# Altium project Morpheus_middle.PrjPcb
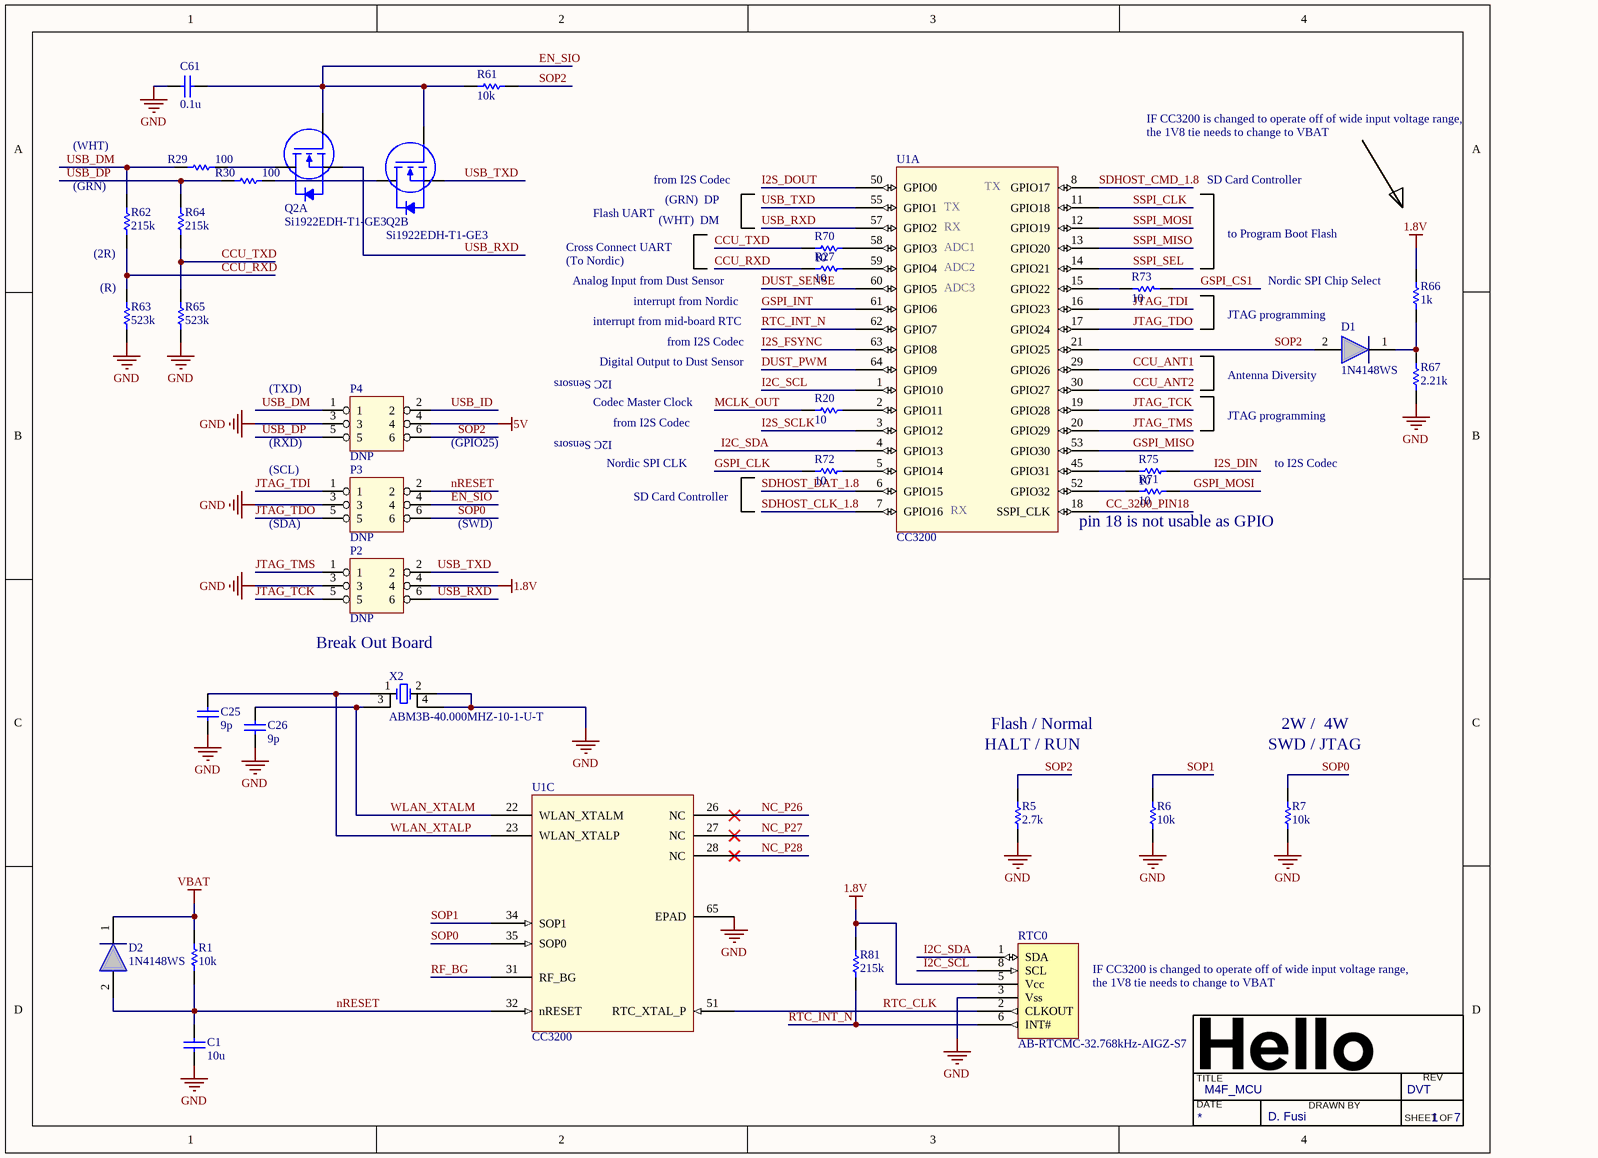
[diagram p0: M4F_MCU.SchDoc]
7 sheets, 151 parts. Net scope: global (net labels, ports and power ports of the same name join across sheets).
Board file: Morpheus_middle.PcbDoc
Sheets:
  M4F_MCU.SchDoc
  Morpheus_middle.SchDoc
  M4F_MCU_Power.SchDoc
  Air_quality.SchDoc
  Flash.SchDoc
  M4F_MCU_Antennas.SchDoc
  SD_Card.SchDoc

## Sheet M4F_MCU.SchDoc: M4F_MCU
size Letter; DrawnBy: D. Fusi; DocumentNumber: 1; Revision: DVT; SheetNumber: 1; SheetTotal: 7

### Parts
C1  10u  [CAP0603_SENSE_DVT]
C25  9p  [CAP0402_SENSE_DVT]
C26  9p  [CAP0402_SENSE_DVT]
C61  0.1u  [CAP0603_SENSE_DVT]
D1  1N4148WS  [SOD-323]
D2  1N4148WS  [SOD-323]
P2  DNP  [HDR2.00-2X3-SMD]
P3  DNP  [HDR2.00-2X3-SMD]
P4  DNP  [HDR2.00-2X3-SMD]
Q2  Si1922EDH-T1-GE3  [SC-70-6]  (parts A,B of 2)
R1  10k  [RES0402_SENSE_DVT]
R5  2.7k  [RES0402_SENSE_DVT]
R6  10k  [RES0402_SENSE_DVT]
R7  10k  [RES0402_SENSE_DVT]
R20  10  [RES0402_SENSE_DVT]
R27  10  [RES0402_SENSE_DVT]
R29  100  [RES0402_SENSE_DVT]
R30  100  [RES0402_SENSE_DVT]
R61  10k  [RES0402_SENSE_DVT]
R62  215k  [RES0402_SENSE_DVT]
R63  523k  [RES0402_SENSE_DVT]
R64  215k  [RES0402_SENSE_DVT]
R65  523k  [RES0402_SENSE_DVT]
R66  1k  [RES0402_SENSE_DVT]
R67  2.21k  [RES0402]
R70  10  [RES0402_SENSE_DVT]
R71  10  [RES0402_SENSE_DVT]
R72  10  [RES0402_SENSE_DVT]
R73  10  [RES0402_SENSE_DVT]
R75  10  [RES0402_SENSE_DVT]
R81  215k  [RES0402_SENSE_DVT]
RTC0  AB-RTCMC-32.768kHz-AIGZ-S7  [8-CLCC]
U1  CC3200  [QFN50P900X900X100_HS-65N]  (parts A,C of 3)
X2  ABM3B-40.000MHZ-10-1-U-T  [ABM3B_CRYSTAL]

### Nets
1.8V: P2.4 R66.2 R81.2 RTC0.5(Vcc)
5V: P4.4
GND: C1.1 C25.1 C26.1 C61.2 P2.3 P3.3 P4.3 R5.1 R6.1 R7.1 R63.1 R65.1 R67.1 RTC0.3(Vss) U1.65(EPAD) X2.2 X2.4
VBAT: D2.1(Cathode) R1.2
CC_3200_PIN18: U1.18(SSPI_CLK)
CCU_ANT1: U1.29(GPIO26)
CCU_ANT2: U1.30(GPIO27)
CCU_RXD: R27.2 R62.1 R63.2
CCU_TXD: R64.1 R65.2 R70.2
DUST_PWM: U1.64(GPIO9)
DUST_SENSE: U1.60(GPIO5)
EN_SIO: C61.1 P3.4 Q2.2(G1) Q2.5(G2) R61.2
GSPI_CLK: R72.2
GSPI_CS1: R73.2
GSPI_INT: U1.61(GPIO6)
GSPI_MISO: U1.53(GPIO30)
GSPI_MOSI: R71.1
I2C_SCL: RTC0.8(SCL) U1.1(GPIO10)
I2C_SDA: RTC0.1(SDA) U1.4(GPIO13)
I2S_DIN: R75.1
I2S_DOUT: U1.50(GPIO0)
I2S_FSYNC: U1.63(GPIO8)
I2S_SCLK: U1.3(GPIO12)
JTAG_TCK: P2.5 U1.19(GPIO28)
JTAG_TDI: P3.1 U1.16(GPIO23)
JTAG_TDO: P3.5 U1.17(GPIO24)
JTAG_TMS: P2.1 U1.20(GPIO29)
MCLK_OUT: R20.2
NC_P26: U1.26(NC)
NC_P27: U1.27(NC)
NC_P28: U1.28(NC)
nRESET: C1.2 D2.2(Anode) P3.2 R1.1 U1.32(nRESET)
RF_BG: U1.31(RF_BG)
RTC_CLK: RTC0.2(CLKOUT) U1.51(RTC_XTAL_P)
RTC_INT_N: R81.1 RTC0.6(INT#) U1.62(GPIO7)
SDHOST_CLK_1.8: U1.7(GPIO16)
SDHOST_CMD_1.8: U1.8(GPIO17)
SDHOST_DAT_1.8: U1.6(GPIO15)
SOP0: P3.6 R7.2 U1.35(SOP0)
SOP1: R6.2 U1.34(SOP1)
SOP2: D1.2(Anode) P4.6 R5.2 R61.1 U1.21(GPIO25)
SSPI_CLK: U1.11(GPIO18)
SSPI_MISO: U1.13(GPIO20)
SSPI_MOSI: U1.12(GPIO19)
SSPI_SEL: U1.14(GPIO21)
USB_DM: P4.1 R29.1 R62.2
USB_DP: P4.5 R30.1 R64.2
USB_ID: P4.2
USB_RXD: P2.6 Q2.1(S1) U1.57(GPIO2)
USB_TXD: P2.2 Q2.4(S2) U1.55(GPIO1)
WLAN_XTALM: C26.2 U1.22(WLAN_XTALM) X2.3
WLAN_XTALP: C25.2 U1.23(WLAN_XTALP) X2.1
NetD1_1: D1.1(Cathode) R66.1 R67.2
NetQ2_3: Q2.3(D2) R30.2
NetQ2_6: Q2.6(D1) R29.2
NetR20_1: R20.1 U1.2(GPIO11)
NetR27_1: R27.1 U1.59(GPIO4)
NetR70_1: R70.1 U1.58(GPIO3)
NetR71_2: R71.2 U1.52(GPIO32)
NetR72_1: R72.1 U1.5(GPIO14)
NetR73_1: R73.1 U1.15(GPIO22)
NetR75_2: R75.2 U1.45(GPIO31)

Not connected (* = marked no-connect by the designer): RTC0 4(NC) 7(NC)

### Notes on the sheet
- (WHT)
- IF CC3200 is changed to operate off of wide input voltage range,
- the 1V8 tie needs to change to VBAT
- (near R62) (GRN)
- Flash UART
- from I2S Codec
- (WHT)  DM
- (GRN)  DP
- (near U1) RX
- (near U1) TX
- SD Card Controller
- to Program Boot Flash
- (near R62) (2R)
- (near R63) (R)
- Cross Connect UART
- (To Nordic)
- Analog Input from Dust Sensor
- (near U1) ADC1
- (near U1) ADC2
- (near U1) ADC3
- (near R66) Nordic SPI Chip Select
- interrupt from mid-board RTC
- Digital Output to Dust Sensor
- I2C Sensors
- interrupt from Nordic
- (near D1) JTAG programming
- (near P4) (TXD)
- Codec Master Clock
- JTAG programming
- (near D1) Antenna Diversity
- (SCL)
- (RXD)
- (GPIO25)
- Nordic SPI CLK
- to I2S Codec
- (SDA)
- (SWD)
- pin 18 is not usable as GPIO
- Break Out Board
- (near R5) HALT / RUN
- Flash / Normal
- (near R7) SWD / JTAG
- 2W /  4W
- TITLE
- DATE
- DRAWN BY
- REV
- SHEET
- OF

### Library data of the parts
C1 = C_10u_10_6.3_X5R_0603: Chip capacitor; Vendor: TDK; PN: C1608X5R0J106K080AB; Tolerance: 10%; Voltage: 6.3V; Temp: X5R; Hello_PN: 225-00415; Value: 10u; Size: 0603; item_category: Capacitor
C25 C26 = C_9p_0.1_50_C0G_0402: Chip capacitor; Vendor: Murata; PN: GRM1555C1H9R1BA01D; Tolerance: 0.1; Voltage: 50V; Temp: C0G; Hello_PN: 225-00371; Value: 9p; Size: 0402; item_category: Capacitor
C61 = C_0.1u_20_16_X7R_0603: Chip capacitor; Vendor: Samsung; PN: CL10B104MO8NNNC; Tolerance: 20%; Voltage: 16V; Temp: X7R; Hello_PN: 225-00235; Value: 0.1u; Size: 0603
D1 D2 = 1N4148WS: Standard diode, 75V 150mA; Vendor: Fairchild; Hello_PN: 235-00318; PN: 1N4148WS; item_category: Diode
P2-P4 = HDR2.00-2X3-SMD: BOB headers
Q2 = Si1922EDH-T1-GE3: Vishay Dual N-Channel MOSFET Si1922EDH-T1-GE3; Hello_PN: 240-00392; item_category: Transistor; PN: Si1922EDH-T1-GE3; Vendor: Vishay
R1 R6 R7 R61 = R_10k_5_0.1_0402: Chip Resistor; Vendor: Panasonic; Tolerance: 5 %; Power: 0.1 W; PN: ERJ-2GEJ103X; Hello_PN: 220-00409; Model: *; Value: 10k; Size: 0402; item_category: Resistor
R5 = R_2.7k_5_0.1_0402: Chip Resistor; Vendor: Panasonic; Tolerance: 5 %; Power: 0.1 W; PN: ERJ-2GEJ272X; Hello_PN: 220-00248; Model: *; Value: 2.7k; Size: 0402
R20 R27 R70-R73 R75 = R_10_1_0.1_0402: Chip Resistor; Vendor: Panasonic; Tolerance: 1 %; Power: 0.1 W; PN: ERJ-2RKF10R0X; Hello_PN: 220-00405; Model: *; Value: 10; Size: 0402; item_category: Resistor
R29 R30 = R_100_1_0.1_0402: Chip Resistor; Vendor: Panasonic; Tolerance: 1 %; Power: 0.1 W; PN: ERJ-2RKF1000X; Hello_PN: 220-00404; Model: *; Value: 100; Size: 0402; item_category: Resistor
R62 R64 R81 = R_215k_1_0.1_0402: Chip Resistor; Vendor: Panasonic; Tolerance: 1 %; Power: 0.1 W; PN: ERJ-2RKF2153X; Hello_PN: 220-00301; Model: *; Value: 215k; Size: 0402; item_category: Resistor
R63 R65 = R_523k_1_0.1_0402: Chip Resistor; Vendor: Panasonic; Tolerance: 1 %; Power: 0.1 W; PN: ERJ-2RKF5233X; Hello_PN: 220-00165; Model: *; Value: 523k; Size: 0402; item_category: Resistor
R66 = R_1k_1_0.1_0402: Chip Resistor; Vendor: Panasonic; Tolerance: 1 %; Power: 0.1 W; PN: ERJ-2RKF1001X; Hello_PN: 220-00402; Model: *; Value: 1k; Size: 0402; item_category: Resistor
R67 = R_2.21k_1_0.1_0402_1: Chip Resistor; Vendor: Panasonic; Tolerance: 1 %; Power: 0.1 W; PN: ERJ-2RKF2211X; Hello_PN: 220-00410; Model: *; Value: 2.21k; Size: 0402; item_category: Resistor
RTC0 = AB-RTCMC-32.768kHz-AIGZ-S7: Abracon I2C RTC w/ integrated XO; Hello_PN: 250-00147; item_category: Oscillator/Crystal; PN: AB-RTCMC-32.768kHz-AIGZ-S7; Vendor: Abracon
U1 = CC3200: TI Wi-FI module; Hello_PN: 265-00252; item_category: IC Mixed Signal; Vendor: TI; PN: CC3200
X2 = Crystal_40M_50_50_18_50: Abracon 40 MHz crystal; Hello_PN: 250-00240; item_category: Oscillator/Crystal; PN: ABM3B-40.000MHZ-10-1-U-T; Vendor: Abracon

## Sheet Morpheus_middle.SchDoc: Morpheus_middle
size Letter; DrawnBy: D. Fusi; DocumentNumber: 2; Revision: DVT; SheetNumber: 2; SheetTotal: 7
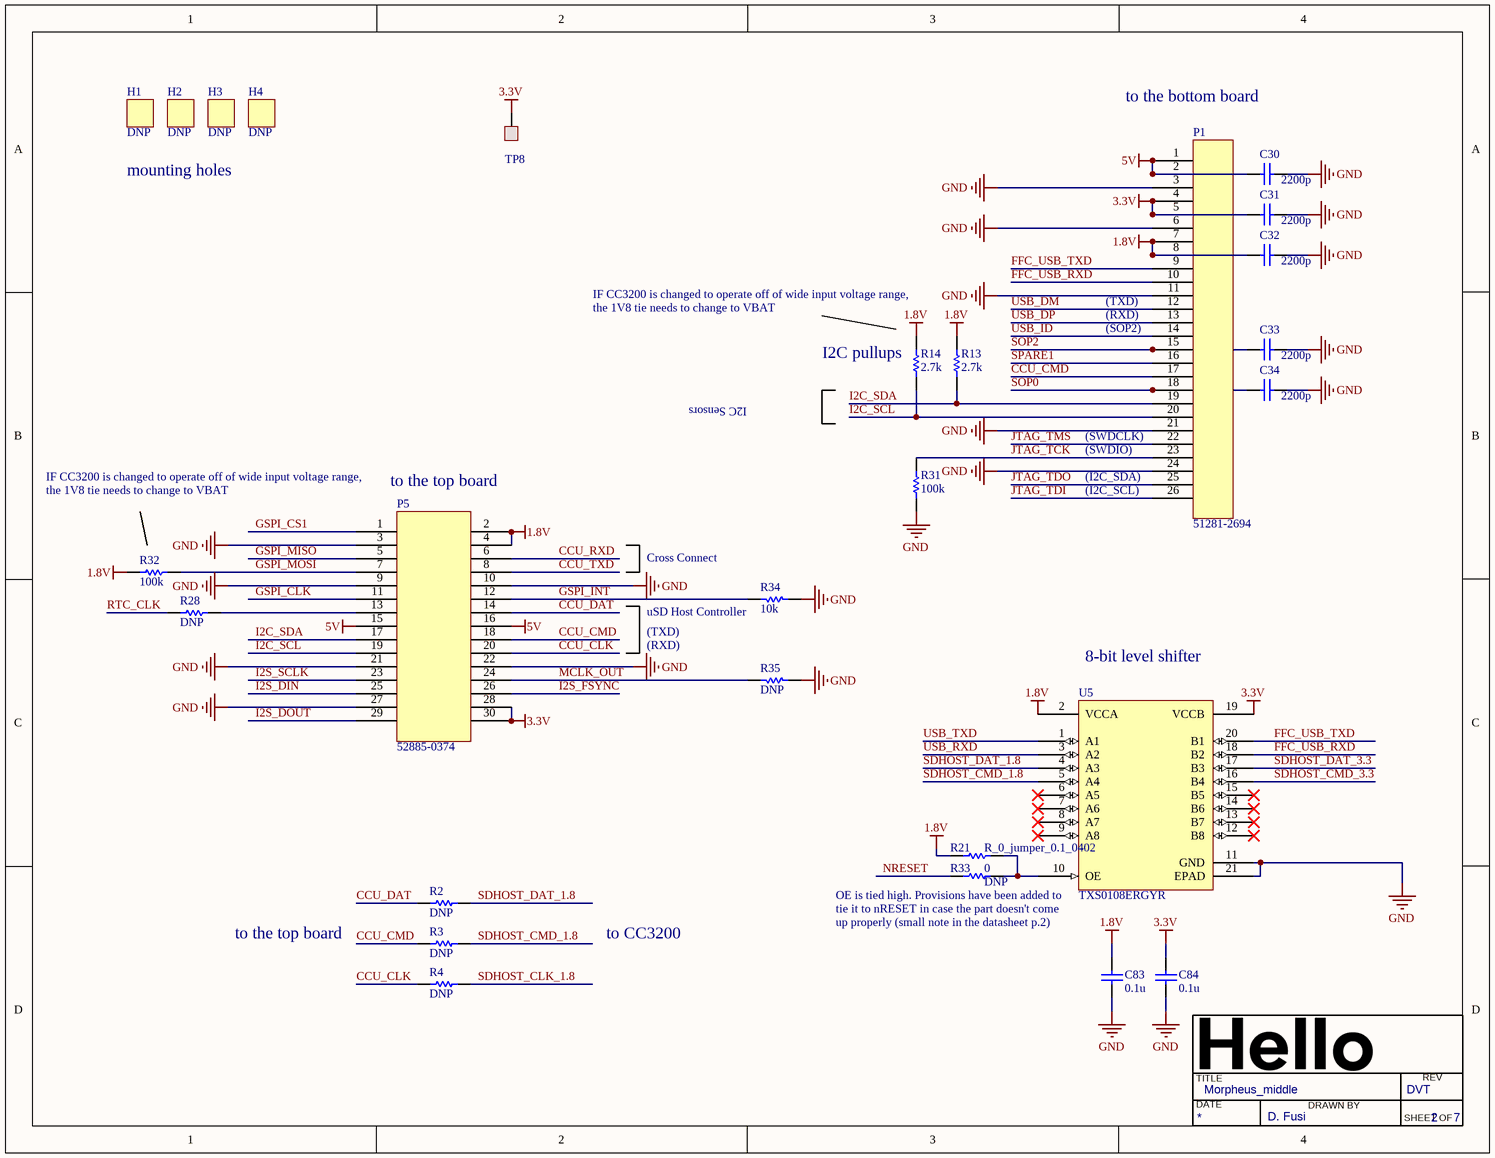
[diagram p1: Morpheus_middle.SchDoc]

### Parts
C30  2200p  [CAP0402_SENSE_DVT]
C31  2200p  [CAP0402_SENSE_DVT]
C32  2200p  [CAP0402_SENSE_DVT]
C33  2200p  [CAP0402_SENSE_DVT]
C34  2200p  [CAP0402_SENSE_DVT]
C83  0.1u  [CAP0402_SENSE_DVT]
C84  0.1u  [CAP0402_SENSE_DVT]
H1  DNP  [HOLE_ROUND_1.8mm]
H2  DNP  [HOLE_ROUND_1.8mm]
H3  DNP  [HOLE_ROUND_1.8mm]
H4  DNP  [HOLE_ROUND_1.8mm]
P1  51281-2694  [molex_51281-2694]
P5  52885-0374  [molex_52885-0374]
R2  DNP  [RES0402-SENSE-DVT]
R3  DNP  [RES0402-SENSE-DVT]
R4  DNP  [RES0402-SENSE-DVT]
R13  2.7k  [RES0402_SENSE_DVT]
R14  2.7k  [RES0402_SENSE_DVT]
R21  R_0_jumper_0.1_0402  [RES0402-SENSE-DVT]
R28  DNP  [RES0402-SENSE-DVT]
R31  100k  [RES0402_SENSE_DVT]
R32  100k  [RES0402_SENSE_DVT]
R33  DNP  value 0  [RES0402-SENSE-DVT]
R34  10k  [RES0402_SENSE_DVT]
R35  DNP  [RES0402_SENSE_DVT]
TP8  TP  [TP-1.1]  (value not drawn)
U5  TXS0108ERGYR  [QFN50P450X350X100_HS-21N]

### Nets
1.8V: C32.1 C83.2 P1.7 P1.8 P5.2 P5.4 R13.2 R14.2 R21.1 R32.2 U5.2(VCCA)
3.3V: C31.1 C84.2 P1.4 P1.5 P5.28 P5.30 TP8.1 U5.19(VCCB)
5V: C30.1 P1.1 P1.2 P5.15 P5.16
GND: C30.2 C31.2 C32.2 C33.2 C34.2 C83.1 C84.1 P1.3 P1.6 P1.11 P1.21 P1.24 P5.3 P5.9 P5.10 P5.21 P5.22 P5.27 R31.1 R34.2 R35.2 U5.11(GND) U5.21(EPAD)
CCU_CLK: P5.20 R4.1
CCU_CMD: P1.17 P5.18 R3.1
CCU_DAT: P5.14 R2.1
CCU_RXD: P5.6
CCU_TXD: P5.8
FFC_USB_RXD: P1.10 U5.18(B2)
FFC_USB_TXD: P1.9 U5.20(B1)
GSPI_CLK: P5.11
GSPI_CS1: P5.1
GSPI_INT: P5.12 R34.1
GSPI_MISO: P5.5
GSPI_MOSI: P5.7 R32.1
I2C_SCL: P1.20 P5.19 R14.1
I2C_SDA: P1.19 P5.17 R13.1
I2S_DIN: P5.25
I2S_DOUT: P5.29
I2S_FSYNC: P5.26
I2S_SCLK: P5.23
JTAG_TCK: P1.23 R31.2
JTAG_TDI: P1.26
JTAG_TDO: P1.25
JTAG_TMS: P1.22
MCLK_OUT: P5.24 R35.1
nRESET: R33.1
RTC_CLK: R28.1
SDHOST_CLK_1.8: R4.2
SDHOST_CMD_1.8: R3.2 U5.5(A4)
SDHOST_CMD_3.3: U5.16(B4)
SDHOST_DAT_1.8: R2.2 U5.4(A3)
SDHOST_DAT_3.3: U5.17(B3)
SOP0: C34.1 P1.18
SOP2: C33.1 P1.15
SPARE1: P1.16
USB_DM: P1.12
USB_DP: P1.13
USB_ID: P1.14
USB_RXD: U5.3(A2)
USB_TXD: U5.1(A1)
NetP5_13: P5.13 R28.2
NetR21_2: R21.2 R33.2 U5.10(OE)

Not connected (* = marked no-connect by the designer): U5 6(A5)* 7(A6)* 8(A7)* 9(A8)* 12(B8)* 13(B7)* 14(B6)* 15(B5)*

### Notes on the sheet
- to the bottom board
- mounting holes
- IF CC3200 is changed to operate off of wide input voltage range,
- the 1V8 tie needs to change to VBAT
- (near R14) I2C pullups
- (TXD)
- (RXD)
- (near P1) (SOP2)
- I2C Sensors
- (near P5) IF CC3200 is changed to operate off of wide input voltage range,
- (near P5) to the top board
- (SWDCLK)
- (SWDIO)
- (near P1) (I2C_SCL)
- (near P1) (I2C_SDA)
- (near R34) Cross Connect
- (near R34) uSD Host Controller
- (near U5) 8-bit level shifter
- OE is tied high. Provisions have been added to
- tie it to nRESET in case the part doesn't come
- to the top board
- to CC3200
- up properly (small note in the datasheet p.2)
- TITLE
- DATE
- DRAWN BY
- REV
- SHEET
- OF

### Library data of the parts
C30-C34 = C_2200p_5_16_STD_0402: Chip capacitor; Vendor: Taiyo Yuden; PN: EMK105SD222JV-F; Tolerance: 5 %; Voltage: 16V; Temp: Standard; Hello_PN: 225-00417; Value: 2200p; Size: 0402; item_category: Capacitor
C83 C84 = C_0.1u_10_50_X7R_0402: Chip capacitor; Vendor: Taiyo Yuden; PN: UMK105B7104KV-FR; Tolerance: 10%; Voltage: 50V; Temp: X7R; Hello_PN: 225-00468; Value: 0.1u; Size: 0402; item_category: Capacitor
H1-H4 = Hole: general purpose hole
P1 = molex_51281-2694: Molex 26-pin 0.5mm pitch connector; Hello_PN: 280-00202; PN: 51281-2694; Vendor: Molex; item_category: Connector
P5 = molex_52885-0374: Molex 30-pin 0.635mm pitch receptacle connector; Hello_PN: 280-00241; PN: 52885-0374; Vendor: Molex; item_category: Connector
R2-R4 R21 R28 = R_0_jumper_0.1_0402: Chip Resistor; Value: 0; Vendor: Panasonic; Tolerance: Jumper; Power: 0.1 W; PN: ERJ-2GE0R00X; Hello_PN: 220-00408; Model: *; Size: 0402; item_category: Resistor
R13 R14 = R_2.7k_5_0.1_0402: as R5 on sheet M4F_MCU; Model: *; Value: 2.7k; Size: 0402
R31 R32 = R_100k_1_0.1_0402: Chip Resistor; Vendor: Panasonic; Tolerance: 1 %; Power: 0.1 W; PN: ERJ-2RKF1003X; Hello_PN: 220-00403; Model: *; Value: 100k; Size: 0402; item_category: Resistor
R33 = R_0_jumper_0.1_0402: Chip Resistor; Vendor: Panasonic; Tolerance: Jumper; Power: 0.1 W; PN: ERJ-2GE0R00X; Hello_PN: 220-00408; Model: *; Size: 0402; item_category: Resistor
R34 = R_10k_5_0.1_0402: as R1 on sheet M4F_MCU; Model: *; Value: 10k; Size: 0402; item_category: Resistor
R35 = R_10k_5_0.1_0402: Chip Resistor; Value: 10k; Vendor: Panasonic; Tolerance: 5 %; Power: 0.1 W; PN: ERJ-2GEJ103X; Hello_PN: 220-00409; Model: *; Size: 0402; item_category: Resistor
TP8 = TP: testpoint
U5 = TXS0108ERGYR: 8-BIT BIDIRECTIONAL VOLTAGE-LEVEL TRANSLATOR  FOR OPEN-DRAIN AND PUSH-PULL APPLICATIONS; Vendor: TI; Hello_PN: 255-00354; item_category: IC_Digital; PN: TXS0108ERGYR

## Sheet M4F_MCU_Power.SchDoc: M4F_MCU_Power
size Letter; DrawnBy: D. Fusi; DocumentNumber: 3; Revision: DVT; SheetNumber: 3; SheetTotal: 7
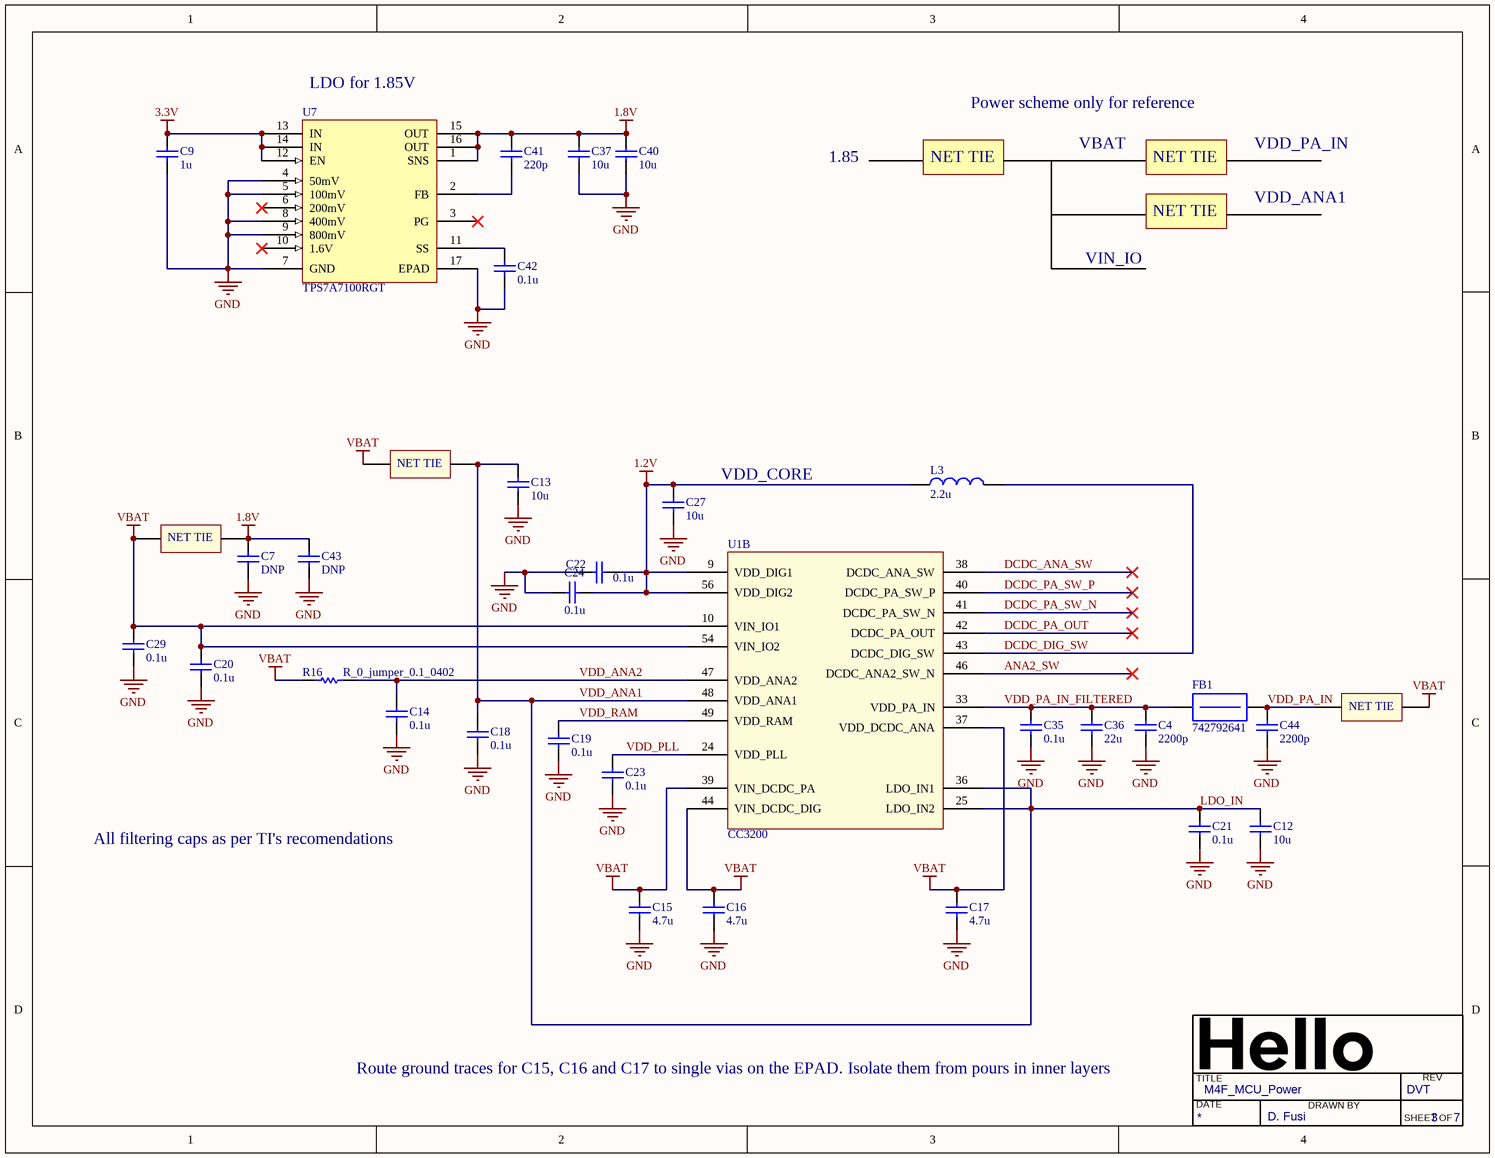
[diagram p2: M4F_MCU_Power.SchDoc]

### Parts
C4  2200p  [CAP0402_SENSE_DVT]
C7  DNP  [CAP1206_SENSE_DVT]
C9  1u  [CAP0603_SENSE_DVT]
C12  10u  [CAP0603_SENSE_DVT]
C13  10u  [CAP0603_SENSE_DVT]
C14  0.1u  [CAP0603_SENSE_DVT]
C15  4.7u  [CAP0603_SENSE_DVT]
C16  4.7u  [CAP0603_SENSE_DVT]
C17  4.7u  [CAP0603_SENSE_DVT]
C18  0.1u  [CAP0603_SENSE_DVT]
C19  0.1u  [CAP0603_SENSE_DVT]
C20  0.1u  [CAP0603_SENSE_DVT]
C21  0.1u  [CAP0603_SENSE_DVT]
C22  0.1u  [CAP0603_SENSE_DVT]
C23  0.1u  [CAP0603_SENSE_DVT]
C24  0.1u  [CAP0603_SENSE_DVT]
C27  10u  [CAP0603_SENSE_DVT]
C29  0.1u  [CAP0603_SENSE_DVT]
C35  0.1u  [CAP0603_SENSE_DVT]
C36  22u  [CAP0603_SENSE_DVT]
C37  10u  [CAP0805_SENSE_DVT]
C40  10u  [CAP0805_SENSE_DVT]
C41  220p  [CAP0402_SENSE_DVT]
C42  0.1u  [CAP0603_SENSE_DVT]
C43  DNP  [CAP1206_SENSE_DVT]
C44  2200p  [CAP0402_SENSE_DVT]
FB1  742792641  [RES0603_SENSE_DVT]
L3  2.2u  [IND_1008]
NT1  NT  [Net_tie_50mil]  (value not drawn)  (net tie, no BOM)
NT2  NT  [Net_tie_50mil]  (value not drawn)  (net tie, no BOM)
NT3  NT  [Net_tie_50mil]  (value not drawn)  (net tie, no BOM)
R16  R_0_jumper_0.1_0402  [RES0402-SENSE-DVT]
U1  CC3200  [QFN50P900X900X100_HS-65N]  (part B of 3)
U7  TPS7A7100RGT  [QFN50P300X300X100_HS-17N]

### Nets
1.2V: C22.2 C24.1 C27.2 L3.1 U1.9(VDD_DIG1) U1.56(VDD_DIG2)
1.8V: C7.2 C37.2 C40.2 C41.2 C43.2 NT2.2 U7.1(SNS) U7.15(OUT) U7.16(OUT)
3.3V: C9.2 U7.12(EN) U7.13(IN) U7.14(IN)
GND: C4.1 C7.1 C9.1 C12.1 C13.1 C14.1 C15.1 C16.1 C17.1 C18.1 C19.1 C20.1 C21.1 C22.1 C23.1 C24.2 C27.1 C29.1 C35.1 C36.1 C37.1 C40.1 C42.1 C43.1 C44.1 U7.4(50mV) U7.5(100mV) U7.7(GND) U7.8(400mV) U7.9(800mV) U7.17(EPAD)
VBAT: C15.2 C16.2 C17.2 C20.2 C29.2 NT1.1 NT2.1 NT3.2 R16.1 U1.10(VIN_IO1) U1.37(VDD_DCDC_ANA) U1.39(VIN_DCDC_PA) U1.44(VIN_DCDC_DIG) U1.54(VIN_IO2)
ANA2_SW: U1.46(DCDC_ANA2_SW_N)
DCDC_ANA_SW: U1.38(DCDC_ANA_SW)
DCDC_DIG_SW: L3.2 U1.43(DCDC_DIG_SW)
DCDC_PA_OUT: U1.42(DCDC_PA_OUT)
DCDC_PA_SW_N: U1.41(DCDC_PA_SW_N)
DCDC_PA_SW_P: U1.40(DCDC_PA_SW_P)
LDO_IN: C12.2 C13.2 C18.2 C21.2 NT1.2 U1.25(LDO_IN2) U1.36(LDO_IN1) U1.48(VDD_ANA1)  [also labelled VDD_ANA1]
VDD_ANA2: C14.2 R16.2 U1.47(VDD_ANA2)
VDD_PA_IN: C44.2 FB1.2 NT3.1
VDD_PA_IN_FILTERED: C4.2 C35.2 C36.2 FB1.1 U1.33(VDD_PA_IN)
VDD_PLL: C23.2 U1.24(VDD_PLL)
VDD_RAM: C19.2 U1.49(VDD_RAM)
NetC41_1: C41.1 U7.2(FB)
NetC42_2: C42.2 U7.11(SS)

Not connected (* = marked no-connect by the designer): U7 3(PG)* 6(200mV)* 10(1.6V)*

### Notes on the sheet
- (near U7) LDO for 1.85V
- 1.85
- NET TIE
- Power scheme only for reference
- VBAT
- VDD_PA_IN
- VDD_ANA1
- VIN_IO
- (near C27) VDD_CORE
- All filtering caps as per TI's recomendations
- Route ground traces for C15, C16 and C17 to single vias on the EPAD. Isolate them from pours in inner layers
- TITLE
- DATE
- DRAWN BY
- REV
- SHEET
- OF
- (in symbol Net tie_50mil) NET TIE

### Library data of the parts
C4 C44 = C_2200p_5_16_STD_0402: as C30 on sheet Morpheus_middle; Value: 2200p; Size: 0402; item_category: Capacitor
C7 C43 = C_100u_20_6.3_X5R_1206: Chip capacitor; Value: 100u; Vendor: TDK; PN: C3216X5R0J107M160AB; Tolerance: 20%; Voltage: 6.3V; Temp: X5R; Hello_PN: 225-00043; Size: 1206; item_category: Capacitor
C9 = C_1u_10_16_X5R_0603: Chip capacitor; Vendor: TDK; PN: C0603C105K4PACTU; Tolerance: 10%; Voltage: 16V; Temp: X5R; Hello_PN: 225-00057; Value: 1u; Size: 0603; item_category: Capacitor
C12 C13 C27 = C_10u_10_6.3_X5R_0603: as C1 on sheet M4F_MCU; Value: 10u; Size: 0603; item_category: Capacitor
C14 C18-C24 C29 C35 C42 = C_0.1u_20_16_X7R_0603: as C61 on sheet M4F_MCU; Value: 0.1u; Size: 0603
C15-C17 = C_4.7u_20_10_X5R_0603: Chip capacitor; Vendor: TDK; PN: CGB3B1X5R1A475M055AC; Tolerance: 20%; Voltage: 10V; Temp: X5R; Hello_PN: 225-00050; Value: 4.7u; Size: 0603; item_category: Capacitor
C36 = C_22u_10_20_JB_0603: Chip capacitor; Vendor: TDK; PN: C1608JB1A226M080AC; Tolerance: 20%; Voltage: 10V; Temp: JB; Value: 22u; Size: 0603
C37 C40 = C_10u_20_10_X7R_0805: Chip capacitor; Vendor: TDK; PN: LMK212AB7106MG-T; Tolerance: 20%; Voltage: 10V; Temp: X7R; Hello_PN: 225-00413; Value: 10u; Size: 0805; item_category: Capacitor
C41 = C_220p_5_50_NP0_0402: Chip capacitor; Vendor: Murata; PN: GRM1555C1H221JA01D; Tolerance: 5%; Voltage: 50V; Temp: NP0; Hello_PN: 225-00329; Value: 220p; Size: 0402; item_category: Capacitor
FB1 = FB_300_2_0.15_0603: Ferrite bead, 300 ohm impedance; Vendor: Wuerth; impedance at 100 MHz: 300; rated current: 2 A; DCR: 0.15 ohm; Hello_PN: 231-00206; PN: 742792641; item_category: Ferrite Bead
L3 = L_2.2u_20_?_0.08_?_1.3: SMD power inductor, 2.2uH; PN: LQM2HPN2R2MG0; Vendor: Murata; Tolerance: 20%; RDC: 0.08; I_max: 1.3; Hello_PN: 230-00316; Value: 2.2u; Q: ?; I_sat: ?; item_category: Inductor
NT1-NT3 = Net tie_50mil: Net tie to bridge 50 mil spacing connector holes
R16 = R_0_jumper_0.1_0402: as R2 on sheet Morpheus_middle; Model: *; Size: 0402; item_category: Resistor
U1 = CC3200: as U1 on sheet M4F_MCU; Vendor: TI; PN: CC3200
U7 = TPS7A7100RGT: 1A fast-transient LDO; Vendor: TI; Hello_PN: 260-00035; item_category: IC_Digital; PN: TPS7A7100RGT

## Sheet Air_quality.SchDoc: Air_quality
size Letter; DrawnBy: D. Fusi; DocumentNumber: 4; Revision: PVT; SheetNumber: 4; SheetTotal: 7
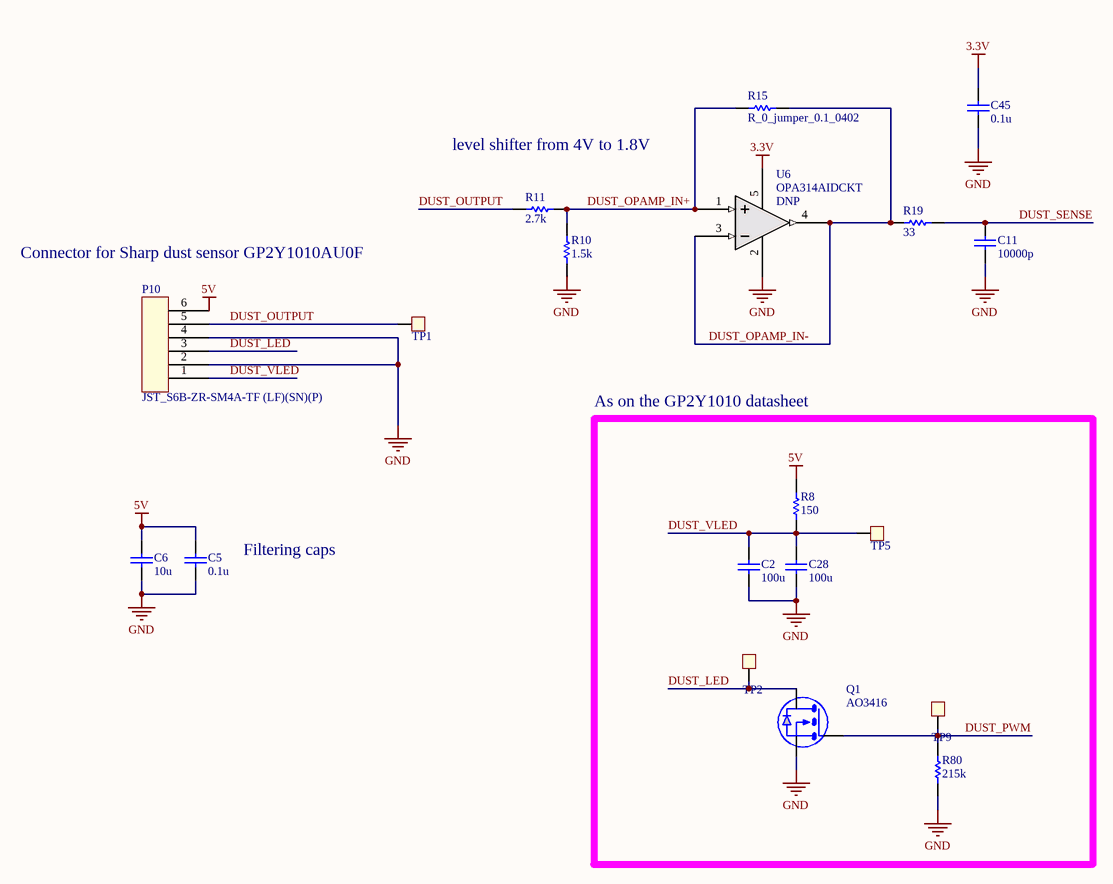
[diagram p3: Air_quality.SchDoc]

### Parts
C2  100u  [CAP1206_SENSE_DVT]
C5  0.1u  [CAP0603_SENSE_DVT]
C6  10u  [CAP0603_SENSE_DVT]
C11  10000p  [CAP0402_SENSE_DVT]
C28  100u  [CAP1206_SENSE_DVT]
C45  0.1u  [CAP0402_SENSE_DVT]
P10  JST_S6B-ZR-SM4A-TF (LF)(SN)(P)  [JST_S6B-ZR-SM4A-TF (LF)(SN)(P)]
Q1  AO3416  [SOT-23]
R8  150  [RES0805_SENSE_DVT]
R10  1.5k  [RES0603_SENSE_DVT]
R11  2.7k  [RES0402_SENSE_DVT]
R15  R_0_jumper_0.1_0402  [RES0402-SENSE-DVT]
R19  33  [RES0402_SENSE_DVT]
R80  215k  [RES0402_SENSE_DVT]
TP1  TP  [TP-1.1]  (value not drawn)
TP2  TP  [TP-1.1]  (value not drawn)
TP5  TP  [TP-1.1]  (value not drawn)
TP9  TP  [TP-1.1]  (value not drawn)
U6  DNP  [SC-70-5]

### Blocks framed on the sheet
As on the GP2Y1010 datasheet: C2 C28 Q1 R8 R80 TP2 TP5 TP9

### Nets
3.3V: C45.2 U6.5(V+)
5V: C5.2 C6.2 P10.6 R8.2
GND: C2.1 C5.1 C6.1 C11.1 C28.1 C45.1 P10.2 P10.4 Q1.2(S) R10.2 R80.1 U6.2(V-)
DUST_LED: P10.3 Q1.3(D) TP2.1
DUST_OPAMP_IN+: R10.1 R11.2 R15.1 U6.1(IN+)
DUST_OPAMP_IN-: R15.2 R19.1 U6.3(IN-) U6.4(OUT)
DUST_OUTPUT: P10.5 R11.1 TP1.1
DUST_PWM: Q1.1(G) R80.2 TP9.1
DUST_SENSE: C11.2 R19.2
DUST_VLED: C2.2 C28.2 P10.1 R8.1 TP5.1

### Notes on the sheet
- level shifter from 4V to 1.8V
- Connector for Sharp dust sensor GP2Y1010AU0F
- (near C5) Filtering caps
- TITLE
- DATE
- DRAWN BY
- REV
- SHEET
- OF

### Library data of the parts
C2 C28 = C_100u_20_10_X5R_1206: Chip capacitor; Vendor: TDK; PN: C3216X5R1A107M160AC; Tolerance: 20%; Voltage: 10V; Temp: X5R; Hello_PN: 225-00304; Value: 100u; Size: 1206; item_category: Capacitor
C5 = C_0.1u_20_16_X7R_0603: as C61 on sheet M4F_MCU; Value: 0.1u; Size: 0603
C6 = C_10u_10_6.3_X5R_0603: as C1 on sheet M4F_MCU; Value: 10u; Size: 0603; item_category: Capacitor
C11 = C_10000p_10_50_X7R_0402: Chip capacitor; Vendor: Taiyo Yuden; PN: UMK105B7103KV-F; Tolerance: 10%; Voltage: 50V; Temp: X7R; Hello_PN: 225-00349; Value: 10000p; Size: 0402; item_category: Capacitor
C45 = C_0.1u_10_50_X7R_0402: as C83 on sheet Morpheus_middle; Value: 0.1u; Size: 0402; item_category: Capacitor
P10 = JST_S6B-ZR-SM4A-TF (LF)(SN)(P): 6-pin JST connector; Hello_PN: 280-00256; PN: JST_S6B-ZR-SM4A-TF (LF)(SN)(P); Vendor: JST; item_category: Connector
Q1 = AO3416: N-channel enhancement mode FET; Vendor: Alpha and Omega; Hello_PN: 240-00234; item_category: Transistor; PN: AO3416
R8 = R_150_5_0.125_0805: Chip Resistor; Vendor: Panasonic; Tolerance: 5 %; Power: 0.125 W; PN: ERJ-6GEYJ151V; Hello_PN: 220-00406; Model: *; Value: 150; Size: 0805; item_category: Resistor
R10 = R_1.5k_1_0.1_0603: Chip Resistor; Vendor: Panasonic; Tolerance: 1 %; Power: 0.1 W; PN: ERJ-3EKF1501V; Hello_PN: 220-00407; Model: *; Value: 1.5k; Size: 0603; item_category: Resistor
R11 = R_2.7k_1_0.1_0402: RES SMD 2.7K OHM 1% 1/16W 0402; Vendor: Yageo; PN: RC0402JR-072K7L; Hello_PN: 220-00446; Model: *; Value: 2.7k; Tolerance: 1 %; Power: 1/16W; Size: 0402
R15 = R_0_jumper_0.1_0402: as R2 on sheet Morpheus_middle; Model: *; Size: 0402; item_category: Resistor
R19 = R_33_5_0.1_0402: Chip Resistor; Vendor: Panasonic; Tolerance: 5 %; Power: 0.1 W; PN: ERJ-2GEJ330X; Hello_PN: 220-00411; Model: *; Value: 33; Size: 0402; item_category: Resistor
R80 = R_215k_1_0.1_0402: as R62 on sheet M4F_MCU; Model: *; Value: 215k; Size: 0402; item_category: Resistor
TP1 TP2 TP5 TP9 = TP: testpoint
U6 = OPA314AIDCKT: TI single 1.8-5.5V OPAMP; PN: OPA314AIDCKT; Vendor: TI

## Sheet Flash.SchDoc: Flash memory
size Letter; CompanyName: Hello Inc.; DrawnBy: D. Fusi; Organization: Hello Inc.; DocumentNumber: 5; Revision: DVT; SheetNumber: 5; SheetTotal: 7
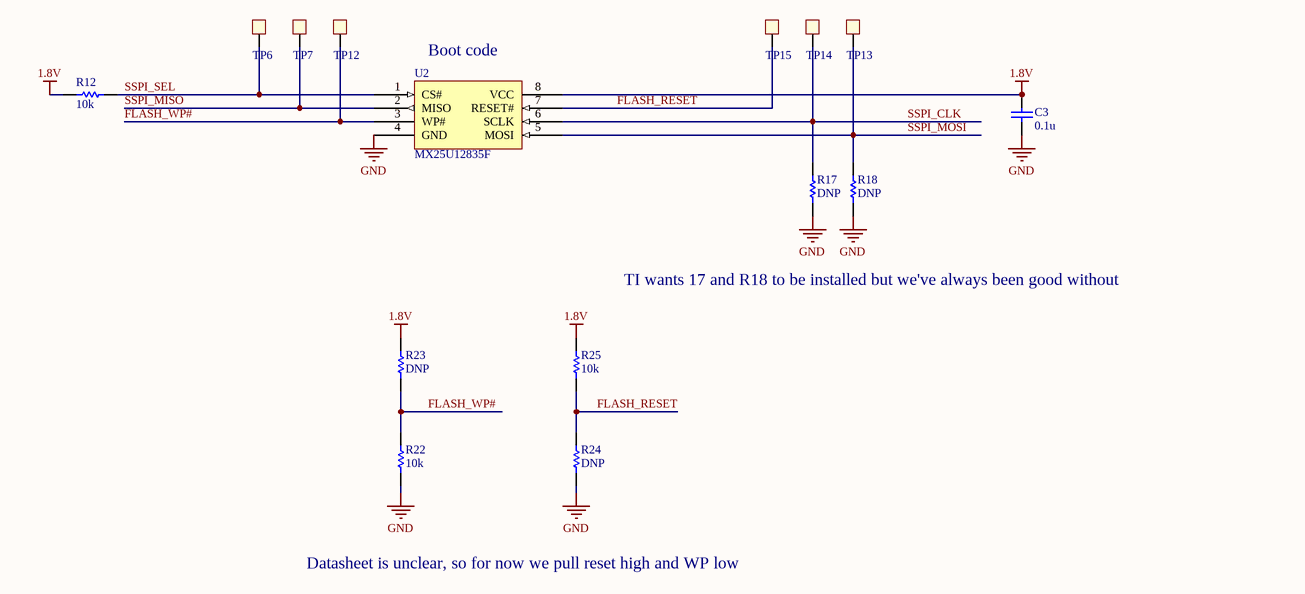
[diagram p4: Flash.SchDoc]

### Parts
C3  0.1u  [CAP0402_SENSE_DVT]
R12  10k  [RES0402_SENSE_DVT]
R17  DNP  [RES0402_SENSE_DVT]
R18  DNP  [RES0402_SENSE_DVT]
R22  10k  [RES0402_SENSE_DVT]
R23  DNP  [RES0402_SENSE_DVT]
R24  DNP  [RES0402_SENSE_DVT]
R25  10k  [RES0402_SENSE_DVT]
TP6  TP  [TP-1.1]  (value not drawn)
TP7  TP  [TP-1.1]  (value not drawn)
TP12  TP  [TP-1.1]  (value not drawn)
TP13  TP  [TP-1.1]  (value not drawn)
TP14  TP  [TP-1.1]  (value not drawn)
TP15  TP  [TP-1.1]  (value not drawn)
U2  MX25U12835F  [WSON 8L]

### Nets
1.8V: C3.2 R12.1 R23.2 R25.2 U2.8(VCC)
GND: C3.1 R17.1 R18.1 R22.1 R24.1 U2.4(GND)
FLASH_RESET: R24.2 R25.1 TP15.1 U2.7(RESET#)
FLASH_WP#: R22.2 R23.1 TP12.1 U2.3(WP#)
SSPI_CLK: R17.2 TP14.1 U2.6(SCLK)
SSPI_MISO: TP7.1 U2.2(MISO)
SSPI_MOSI: R18.2 TP13.1 U2.5(MOSI)
SSPI_SEL: R12.2 TP6.1 U2.1(CS#)

### Notes on the sheet
- (near U2) Boot code
- TI wants 17 and R18 to be installed but we've always been good without
- Datasheet is unclear, so for now we pull reset high and WP low
- TITLE
- DATE
- DRAWN BY
- REV
- SHEET
- OF

### Library data of the parts
C3 = C_0.1u_10_50_X7R_0402: as C83 on sheet Morpheus_middle; Value: 0.1u; Size: 0402; item_category: Capacitor
R12 R22 R25 = R_10k_5_0.1_0402: as R1 on sheet M4F_MCU; Model: *; Value: 10k; Size: 0402; item_category: Resistor
R17 R18 = R_100k_1_0.1_0402: Chip Resistor; Value: 100k; Vendor: Panasonic; Tolerance: 1 %; Power: 0.1 W; PN: ERJ-2RKF1003X; Hello_PN: 220-00403; Model: *; Size: 0402; item_category: Resistor
R23 R24 = R_10k_5_0.1_0402: as R35 on sheet Morpheus_middle; Model: *; Size: 0402; item_category: Resistor
TP6 TP7 TP12-TP15 = TP: testpoint
U2 = MX25U12835F: Macronix MX25U12835F SPI NOR Flash; Hello_PN: 255-00024; item_category: IC_Digital; PN: MX25U12835F; Vendor: Macronix

## Sheet M4F_MCU_Antennas.SchDoc: M4F_MCU_Antennas
size Letter; DrawnBy: D. Fusi; DocumentNumber: 6; Revision: DVT; SheetNumber: 6; SheetTotal: 7
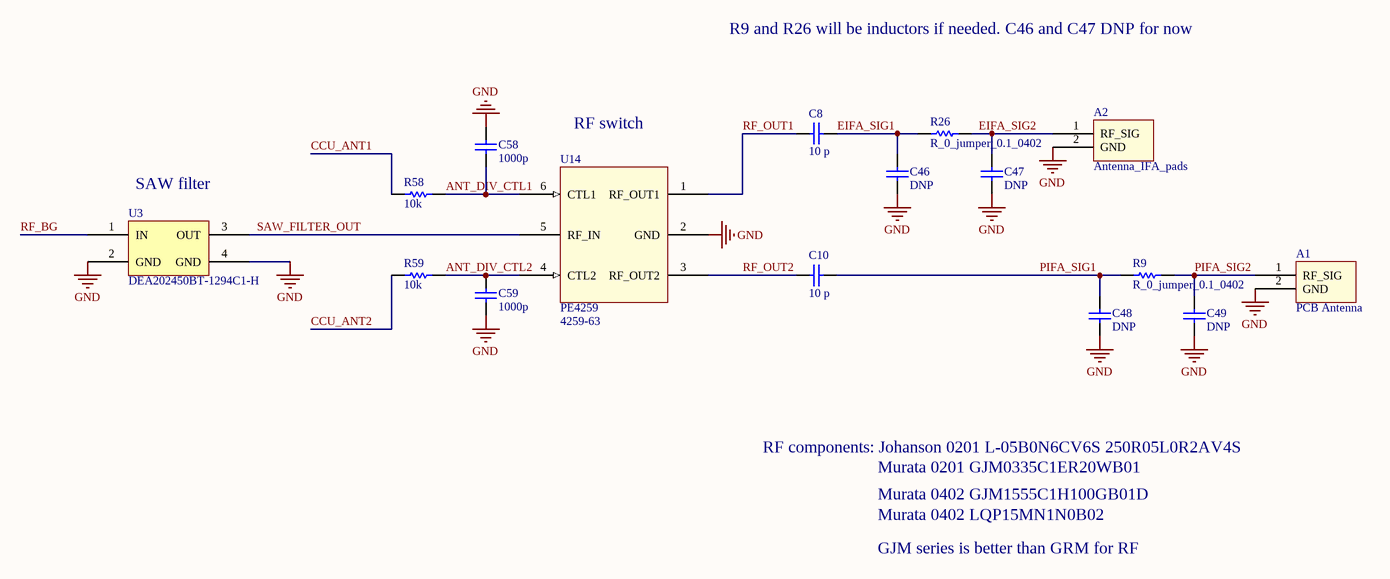
[diagram p5: M4F_MCU_Antennas.SchDoc]

### Parts
A1  PCB Antenna  [Antenna_meander_2.4GHz_middle]  (net tie, no BOM)
A2  Antenna_IFA_pads  [Antenna_Pads]
C8  10 p  [CAP0402_SENSE_DVT]
C10  10 p  [CAP0402_SENSE_DVT]
C46  DNP  [CAP0402_SENSE_DVT]
C47  DNP  [CAP0402_SENSE_DVT]
C48  DNP  [CAP0402_SENSE_DVT]
C49  DNP  [CAP0402_SENSE_DVT]
C58  1000p  [CAP0402_SENSE_DVT]
C59  1000p  [CAP0402_SENSE_DVT]
R9  R_0_jumper_0.1_0402  [RES0402-SENSE-DVT]
R26  R_0_jumper_0.1_0402  [RES0402-SENSE-DVT]
R58  10k  [RES0402_SENSE_DVT]
R59  10k  [RES0402_SENSE_DVT]
U3  DEA202450BT-1294C1-H  [DEA202450BT-1294C1-H]
U14  PE4259  PN: 4259-63  [SOT65P212X110-6N]

### Nets
GND: A1.2(GND) A2.2(GND) C46.2 C47.2 C48.2 C49.2 C58.1 C59.1 U3.2(GND) U3.4(GND) U14.2(GND)
ANT_DIV_CTL1: C58.2 R58.2 U14.6(CTL1)
ANT_DIV_CTL2: C59.2 R59.2 U14.4(CTL2)
CCU_ANT1: R58.1
CCU_ANT2: R59.1
EIFA_SIG1: C8.2 C46.1 R26.1
EIFA_SIG2: A2.1(RF_SIG) C47.1 R26.2
PIFA_SIG1: C10.2 C48.1 R9.1
PIFA_SIG2: A1.1(RF_SIG) C49.1 R9.2
RF_BG: U3.1(IN)
RF_OUT1: C8.1 U14.1(RF_OUT1)
RF_OUT2: C10.1 U14.3(RF_OUT2)
SAW_FILTER_OUT: U3.3(OUT) U14.5(RF_IN)

### Notes on the sheet
- R9 and R26 will be inductors if needed. C46 and C47 DNP for now
- RF switch
- (near U3) SAW filter
- RF components: Johanson 0201 L-05B0N6CV6S 250R05L0R2AV4S
- Murata 0201 GJM0335C1ER20WB01
- Murata 0402 GJM1555C1H100GB01D
- Murata 0402 LQP15MN1N0B02
- GJM series is better than GRM for RF
- TITLE
- DATE
- DRAWN BY
- REV
- SHEET
- OF

### Library data of the parts
A1 = Antenna_meander_2.4GHz_middle: Meander antenna printed on PCB
A2 = Antenna_IFA_pads: PCB pads for external IFA
C8 C10 = C_10p_2_50_C0G_0402: Chip capacitor; Vendor: Murata; PN: GJM1555C1H100GB01D; Tolerance: 2 %; Voltage: 50 V; Temp: C0G; Hello_PN: 225-00348; Value: 10 p; Size: 0402; item_category: Capacitor
C46-C49 = C_2.2p_0.05_50_C0G_0402: Chip capacitor; Value: 2.2 p; Vendor: Murata; PN: GRM1555C1H2R2WA01D; Tolerance: 0.05; Voltage: 50 V; Temp: C0G; Hello_PN: 225-00236; Size: 0402; item_category: Capacitor
C58 C59 = C_1000p_10_50_X7R_0402: Chip capacitor; Vendor: Murata; PN: GRM155R71H102KA01D; Tolerance: 10%; Voltage: 50V; Temp: X7R; Hello_PN: 225-00272; Value: 1000p; Size: 0402; item_category: Capacitor
R9 R26 = R_0_jumper_0.1_0402: as R2 on sheet Morpheus_middle; Model: *; Size: 0402; item_category: Resistor
R58 R59 = R_10k_5_0.1_0402: as R1 on sheet M4F_MCU; Model: *; Value: 10k; Size: 0402; item_category: Resistor
U3 = DEA202450BT-1294C1-H: SAW filter for 2.4 GHz WLAN; Vendor: TDK; Hello_PN: 265-00216; item_category: IC Mixed Signal; PN: DEA202450BT-1294C1-H
U14 = PE4259: RF Switch; Vendor: Peregrine semiconductor; Hello_PN: 270-00292; item_category: RF Component

## Sheet SD_Card.SchDoc: SD_Card
size Letter; DrawnBy: D. Fusi; DocumentNumber: 7; Revision: DVT; SheetNumber: 7; SheetTotal: 7
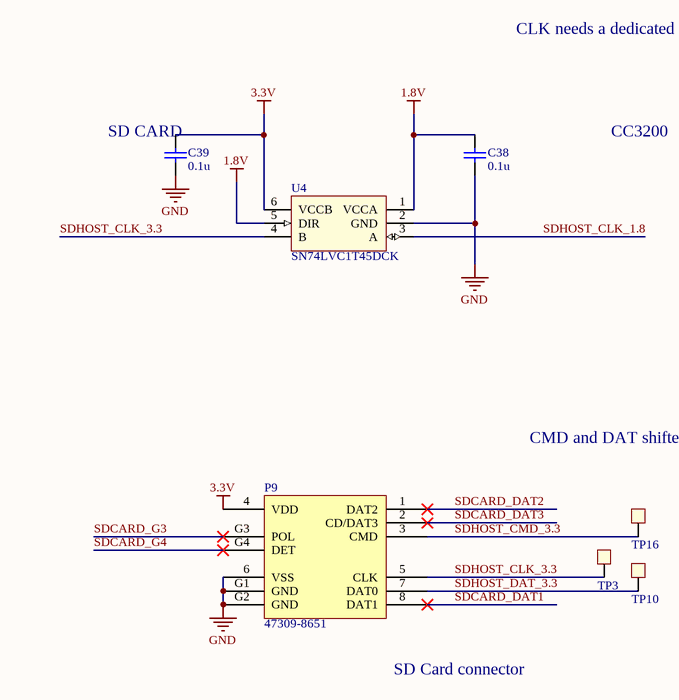
[diagram p6: SD_Card.SchDoc]

### Parts
C38  0.1u  [CAP0402_SENSE_DVT]
C39  0.1u  [CAP0402_SENSE_DVT]
P9  47309-8651  [molex_47309-8651]
TP3  TP  [TP-1.1]  (value not drawn)
TP10  TP  [TP-1.1]  (value not drawn)
TP16  TP  [TP-1.1]  (value not drawn)
U4  SN74LVC1T45DCK  [SC-70-6]

### Nets
1.8V: C38.2 U4.1(VCCA) U4.5(DIR)
3.3V: C39.2 P9.4(VDD) U4.6(VCCB)
GND: C38.1 C39.1 P9.6(VSS) P9.G1(GND) P9.G2(GND) U4.2(GND)
SDCARD_DAT1: P9.8(DAT1)
SDCARD_DAT2: P9.1(DAT2)
SDCARD_DAT3: P9.2(CD/DAT3)
SDCARD_G3: P9.G3(POL)
SDCARD_G4: P9.G4(DET)
SDHOST_CLK_1.8: U4.3(A)
SDHOST_CLK_3.3: P9.5(CLK) TP3.1 U4.4(B)
SDHOST_CMD_3.3: P9.3(CMD) TP16.1
SDHOST_DAT_3.3: P9.7(DAT0) TP10.1

### Notes on the sheet
- CLK needs a dedicated level shifter beacuse of speed
- SD CARD
- CC3200
- CMD and DAT shifter on dedicated level shifter
- SD Card connector
- TITLE
- DATE
- DRAWN BY
- REV
- SHEET
- OF

### Library data of the parts
C38 C39 = C_0.1u_10_50_X7R_0402: as C83 on sheet Morpheus_middle; Value: 0.1u; Size: 0402; item_category: Capacitor
P9 = molex_47309-8651: Molex SD card connector; Hello_PN: 280-00314; PN: 47309-8651; Vendor: Molex; item_category: Connector
TP3 TP10 TP16 = TP: testpoint
U4 = SN74LVC1T45DCK: Single-bit dual-supply bus transceiver; Vendor: TI; Hello_PN: 255-00324; item_category: IC_Digital; PN: SN74LVC1T45DCK

## Nets that join several sheets
1.8V: M4F_MCU (P2.4 R66.2 R81.2 RTC0.5), Morpheus_middle (11 pins), M4F_MCU_Power (9 pins), Flash (5 pins), SD_Card (C38.2 U4.1 U4.5)
3.3V: Morpheus_middle (8 pins), M4F_MCU_Power (C9.2 U7.12 U7.13 U7.14), Air_quality (C45.2 U6.5), SD_Card (C39.2 P9.4 U4.6)
5V: M4F_MCU (P4.4), Morpheus_middle (5 pins), Air_quality (C5.2 C6.2 P10.6 R8.2)
GND: M4F_MCU (17 pins), Morpheus_middle (23 pins), M4F_MCU_Power (31 pins), Air_quality (12 pins), Flash (6 pins), M4F_MCU_Antennas (11 pins), SD_Card (6 pins)
VBAT: M4F_MCU (D2.1 R1.2), M4F_MCU_Power (14 pins)
CCU_ANT1: M4F_MCU (U1.29), M4F_MCU_Antennas (R58.1)
CCU_ANT2: M4F_MCU (U1.30), M4F_MCU_Antennas (R59.1)
CCU_RXD: M4F_MCU (R27.2 R62.1 R63.2), Morpheus_middle (P5.6)
CCU_TXD: M4F_MCU (R64.1 R65.2 R70.2), Morpheus_middle (P5.8)
DUST_PWM: M4F_MCU (U1.64), Air_quality (Q1.1 R80.2 TP9.1)
DUST_SENSE: M4F_MCU (U1.60), Air_quality (C11.2 R19.2)
GSPI_CLK: M4F_MCU (R72.2), Morpheus_middle (P5.11)
GSPI_CS1: M4F_MCU (R73.2), Morpheus_middle (P5.1)
GSPI_INT: M4F_MCU (U1.61), Morpheus_middle (P5.12 R34.1)
GSPI_MISO: M4F_MCU (U1.53), Morpheus_middle (P5.5)
GSPI_MOSI: M4F_MCU (R71.1), Morpheus_middle (P5.7 R32.1)
I2C_SCL: M4F_MCU (RTC0.8 U1.1), Morpheus_middle (P1.20 P5.19 R14.1)
I2C_SDA: M4F_MCU (RTC0.1 U1.4), Morpheus_middle (P1.19 P5.17 R13.1)
I2S_DIN: M4F_MCU (R75.1), Morpheus_middle (P5.25)
I2S_DOUT: M4F_MCU (U1.50), Morpheus_middle (P5.29)
I2S_FSYNC: M4F_MCU (U1.63), Morpheus_middle (P5.26)
I2S_SCLK: M4F_MCU (U1.3), Morpheus_middle (P5.23)
JTAG_TCK: M4F_MCU (P2.5 U1.19), Morpheus_middle (P1.23 R31.2)
JTAG_TDI: M4F_MCU (P3.1 U1.16), Morpheus_middle (P1.26)
JTAG_TDO: M4F_MCU (P3.5 U1.17), Morpheus_middle (P1.25)
JTAG_TMS: M4F_MCU (P2.1 U1.20), Morpheus_middle (P1.22)
MCLK_OUT: M4F_MCU (R20.2), Morpheus_middle (P5.24 R35.1)
nRESET: M4F_MCU (5 pins), Morpheus_middle (R33.1)
RF_BG: M4F_MCU (U1.31), M4F_MCU_Antennas (U3.1)
RTC_CLK: M4F_MCU (RTC0.2 U1.51), Morpheus_middle (R28.1)
SDHOST_CLK_1.8: M4F_MCU (U1.7), Morpheus_middle (R4.2), SD_Card (U4.3)
SDHOST_CMD_1.8: M4F_MCU (U1.8), Morpheus_middle (R3.2 U5.5)
SDHOST_CMD_3.3: Morpheus_middle (U5.16), SD_Card (P9.3 TP16.1)
SDHOST_DAT_1.8: M4F_MCU (U1.6), Morpheus_middle (R2.2 U5.4)
SDHOST_DAT_3.3: Morpheus_middle (U5.17), SD_Card (P9.7 TP10.1)
SOP0: M4F_MCU (P3.6 R7.2 U1.35), Morpheus_middle (C34.1 P1.18)
SOP2: M4F_MCU (5 pins), Morpheus_middle (C33.1 P1.15)
SSPI_CLK: M4F_MCU (U1.11), Flash (R17.2 TP14.1 U2.6)
SSPI_MISO: M4F_MCU (U1.13), Flash (TP7.1 U2.2)
SSPI_MOSI: M4F_MCU (U1.12), Flash (R18.2 TP13.1 U2.5)
SSPI_SEL: M4F_MCU (U1.14), Flash (R12.2 TP6.1 U2.1)
USB_DM: M4F_MCU (P4.1 R29.1 R62.2), Morpheus_middle (P1.12)
USB_DP: M4F_MCU (P4.5 R30.1 R64.2), Morpheus_middle (P1.13)
USB_ID: M4F_MCU (P4.2), Morpheus_middle (P1.14)
USB_RXD: M4F_MCU (P2.6 Q2.1 U1.57), Morpheus_middle (U5.3)
USB_TXD: M4F_MCU (P2.2 Q2.4 U1.55), Morpheus_middle (U5.1)